# EAGLE design AS3364 DG412 bus mixer v1.2 (EAGLE 9.6.2)
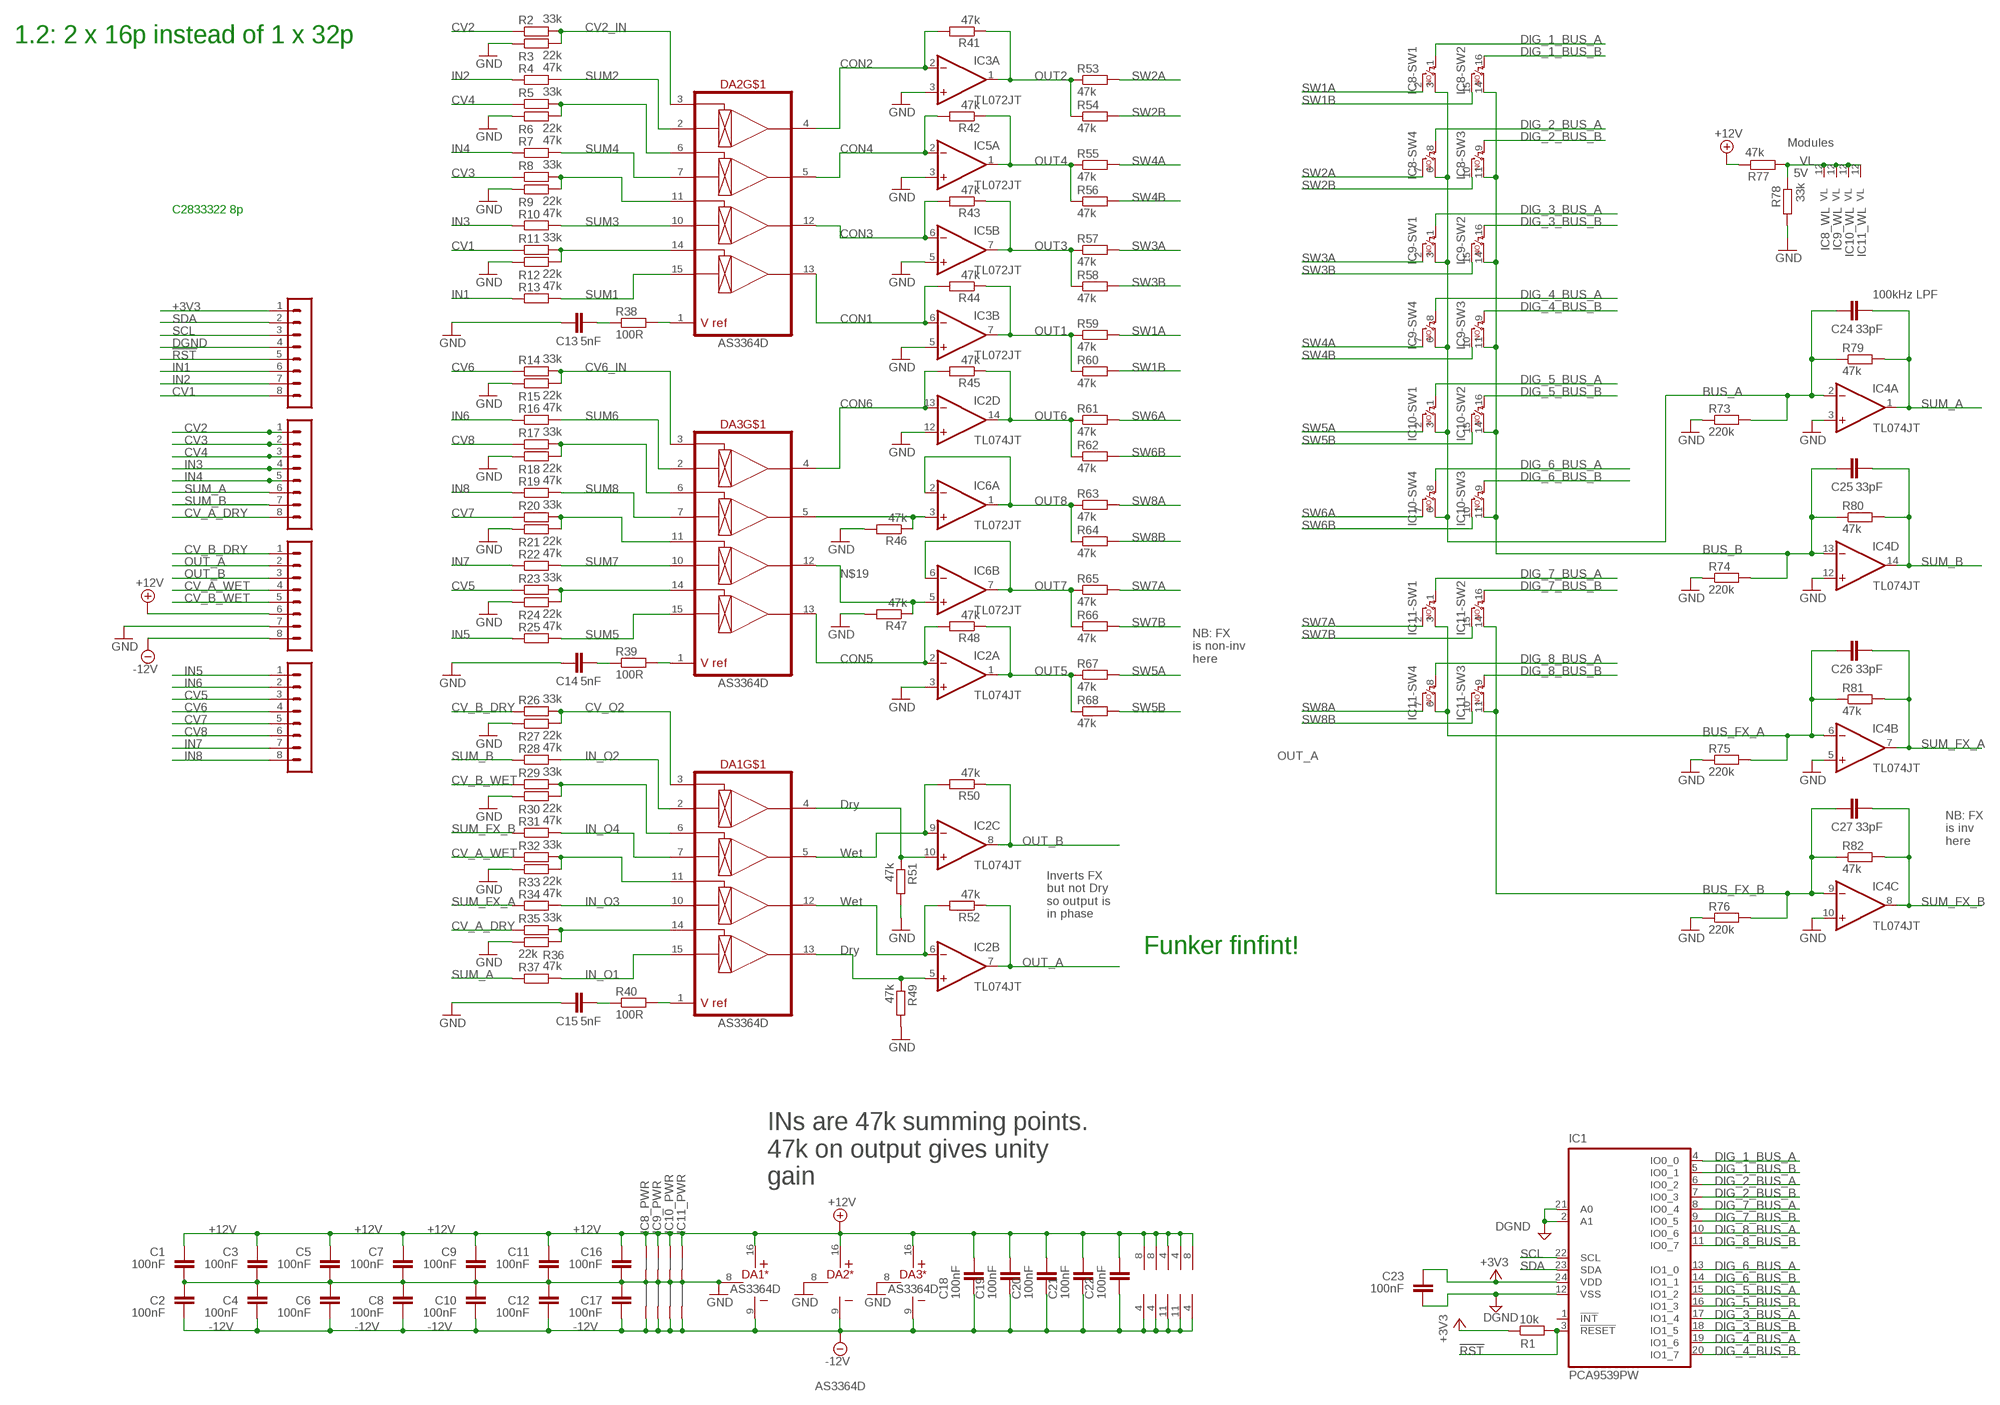
[diagram p0: schematic, sheet 1]

## Parts
C1  100nF  C-EUC0402  [C0402]
C2  100nF  C-EUC0402  [C0402]
C3  100nF  C-EUC0402  [C0402]
C4  100nF  C-EUC0402  [C0402]
C5  100nF  C-EUC0402  [C0402]
C6  100nF  C-EUC0402  [C0402]
C7  100nF  C-EUC0402  [C0402]
C8  100nF  C-EUC0402  [C0402]
C9  100nF  C-EUC0402  [C0402]
C10  100nF  C-EUC0402  [C0402]
C11  100nF  C-EUC0402  [C0402]
C12  100nF  C-EUC0402  [C0402]
C13  5nF  C-EU-J  [C0402-J]
C14  5nF  C-EU-J  [C0402-J]
C15  5nF  C-EU-J  [C0402-J]
C16  100nF  C-EUC0402  [C0402]
C17  100nF  C-EUC0402  [C0402]
C18  100nF  C-EUC0402  [C0402]
C19  100nF  C-EUC0402  [C0402]
C20  100nF  C-EUC0402  [C0402]
C21  100nF  C-EUC0402  [C0402]
C22  100nF  C-EUC0402  [C0402]
C23  100nF  C-EUC0402  [C0402]
C24  33pF  C-EU-J  [C0402-J]
C25  33pF  C-EU-J  [C0402-J]
C26  33pF  C-EU-J  [C0402-J]
C27  33pF  C-EU-J  [C0402-J]
DA1  AS3364D  [DIL16J]
DA2  AS3364D  [DIL16J]
DA3  AS3364D  [DIL16J]
IC1  PCA9539PW  [TSSOP24J]
IC2  TL074JT  [TSSOP14J]
IC3  TL072JT  [TSSOP8J]
IC4  TL074JT  [TSSOP14J]
IC5  TL072JT  [TSSOP8J]
IC6  TL072JT  [TSSOP8J]
IC8  DG412-J  [DIL16J]
IC9  DG412-J  [DIL16J]
IC10  DG412-J  [DIL16J]
IC11  DG412-J  [DIL16J]
R1  10k  R-EU_R0402  [R0402]
R2  33k  R-EU_R0402  [R0402]
R3  22k  R-EU_R0402  [R0402]
R4  47k  R-EU_R0402  [R0402]
R5  33k  R-EU_R0402  [R0402]
R6  22k  R-EU_R0402  [R0402]
R7  47k  R-EU_R0402  [R0402]
R8  33k  R-EU_R0402  [R0402]
R9  22k  R-EU_R0402  [R0402]
R10  47k  R-EU_R0402  [R0402]
R11  33k  R-EU_R0402  [R0402]
R12  22k  R-EU_R0402  [R0402]
R13  47k  R-EU_R0402  [R0402]
R14  33k  R-EU_R0402  [R0402]
R15  22k  R-EU_R0402  [R0402]
R16  47k  R-EU_R0402  [R0402]
R17  33k  R-EU_R0402  [R0402]
R18  22k  R-EU_R0402  [R0402]
R19  47k  R-EU_R0402  [R0402]
R20  33k  R-EU_R0402  [R0402]
R21  22k  R-EU_R0402  [R0402]
R22  47k  R-EU_R0402  [R0402]
R23  33k  R-EU_R0402  [R0402]
R24  22k  R-EU_R0402  [R0402]
R25  47k  R-EU_R0402  [R0402]
R26  33k  R-EU_R0402  [R0402]
R27  22k  R-EU_R0402  [R0402]
R28  47k  R-EU_R0402  [R0402]
R29  33k  R-EU_R0402  [R0402]
R30  22k  R-EU_R0402  [R0402]
R31  47k  R-EU_R0402  [R0402]
R32  33k  R-EU_R0402  [R0402]
R33  22k  R-EU_R0402  [R0402]
R34  47k  R-EU_R0402  [R0402]
R35  33k  R-EU_R0402  [R0402]
R36  22k  R-EU_R0402  [R0402]
R37  47k  R-EU_R0402  [R0402]
R38  100R  R-EU_R0402  [R0402]
R39  100R  R-EU_R0402  [R0402]
R40  100R  R-EU_R0402  [R0402]
R41  47k  R-EU_R0402  [R0402]
R42  47k  R-EU_R0402  [R0402]
R43  47k  R-EU_R0402  [R0402]
R44  47k  R-EU_R0402  [R0402]
R45  47k  R-EU_R0402  [R0402]
R46  47k  R-EU_R0402  [R0402]
R47  47k  R-EU_R0402  [R0402]
R48  47k  R-EU_R0402  [R0402]
R49  47k  R-EU_R0402  [R0402]
R50  47k  R-EU_R0402  [R0402]
R51  47k  R-EU_R0402  [R0402]
R52  47k  R-EU_R0402  [R0402]
R53  47k  R-EU_R0402  [R0402]
R54  47k  R-EU_R0402  [R0402]
R55  47k  R-EU_R0402  [R0402]
R56  47k  R-EU_R0402  [R0402]
R57  47k  R-EU_R0402  [R0402]
R58  47k  R-EU_R0402  [R0402]
R59  47k  R-EU_R0402  [R0402]
R60  47k  R-EU_R0402  [R0402]
R61  47k  R-EU_R0402  [R0402]
R62  47k  R-EU_R0402  [R0402]
R63  47k  R-EU_R0402  [R0402]
R64  47k  R-EU_R0402  [R0402]
R65  47k  R-EU_R0402  [R0402]
R66  47k  R-EU_R0402  [R0402]
R67  47k  R-EU_R0402  [R0402]
R68  47k  R-EU_R0402  [R0402]
R73  220k  R-EU_R0402  [R0402]
R74  220k  R-EU_R0402  [R0402]
R75  220k  R-EU_R0402  [R0402]
R76  220k  R-EU_R0402  [R0402]
R77  47k  R-EU_R0402  [R0402]
R78  33k  R-EU_R0402  [R0402]
R79  47k  R-EU_R0402  [R0402]
R80  47k  R-EU_R0402  [R0402]
R81  47k  R-EU_R0402  [R0402]
R82  47k  R-EU_R0402  [R0402]
SV1  MA08-1JP  [SIP-PIN08-1J]
SV3  MA08-1JP  [SIP-PIN08-1J]
SV4  MA08-1JP  [SIP-PIN08-1J]
SV33  MA08-1JP  [SIP-PIN08-1J]

## Nets
!RST: IC1.3(!RESET) R1.2 SV33.5
+3V3: C23.2 IC1.24(VDD) R1.1 SV33.1
+12V: C1.2 C3.2 C5.2 C7.2 C9.2 C11.2 C16.2 C18.2 C19.2 C20.2 C21.2 C22.2 DA1.16(*:V+) DA2.16(*:V+) DA3.16(*:V+) IC2.4(P:V+) IC3.8(P:V+) IC4.4(P:V+) IC5.8(P:V+) IC6.8(P:V+) IC8.13(_PWR:+15V) IC9.13(_PWR:+15V) IC10.13(_PWR:+15V) IC11.13(_PWR:+15V) R77.1 SV4.6
-12V: C2.1 C4.1 C6.1 C8.1 C10.1 C12.1 C17.1 C18.1 C19.1 C20.1 C21.1 C22.1 DA1.9(*:V-) DA2.9(*:V-) DA3.9(*:V-) IC2.11(P:V-) IC3.4(P:V-) IC4.11(P:V-) IC5.4(P:V-) IC6.4(P:V-) IC8.4(_PWR:-15V) IC9.4(_PWR:-15V) IC10.4(_PWR:-15V) IC11.4(_PWR:-15V) SV4.8
BUS_A: C24.1 IC4.2(A:-IN) IC8.3(-SW1:S) IC8.6(-SW4:S) IC9.3(-SW1:S) IC9.6(-SW4:S) IC10.3(-SW1:S) IC10.6(-SW4:S) R73.2 R79.1
BUS_B: C25.1 IC4.13(D:-IN) IC8.11(-SW3:S) IC8.14(-SW2:S) IC9.11(-SW3:S) IC9.14(-SW2:S) IC10.11(-SW3:S) IC10.14(-SW2:S) R74.2 R80.1
BUS_FX_A: C26.1 IC4.6(B:-IN) IC11.3(-SW1:S) IC11.6(-SW4:S) R75.2 R81.1
BUS_FX_B: C27.1 IC4.9(C:-IN) IC11.11(-SW3:S) IC11.14(-SW2:S) R76.2 R82.1
CON1: DA2.13(OUT4) IC3.6(B:-IN) R44.2
CON2: DA2.4(OUT1) IC3.2(A:-IN) R41.2
CON3: DA2.12(OUT3) IC5.6(B:-IN) R43.2
CON4: DA2.5(OUT2) IC5.2(A:-IN) R42.2
CON5: DA3.13(OUT4) IC2.2(A:-IN) R48.2
CON6: DA3.4(OUT1) IC2.13(D:-IN) R45.2
CON_O1: DA1.12(OUT3) IC2.6(B:-IN) R52.2
CV1: R11.1 SV33.8
CV2: R2.1 SV1.1
CV2_IN: DA2.3(CV1) R2.2 R3.2
CV3: R8.1 SV1.2
CV4: R5.1 SV1.3
CV5: R23.1 SV3.3
CV6: R14.1 SV3.4
CV6_IN: DA3.3(CV1) R14.2 R15.2
CV7: R20.1 SV3.5
CV8: R17.1 SV3.6
CV_A_DRY: R35.1 SV1.8
CV_A_WET: R32.1 SV4.4
CV_B_DRY: R26.1 SV4.1
CV_B_WET: R29.1 SV4.5
CV_O2: DA1.3(CV1) R26.2 R27.2
DGND: C23.1 IC1.2(A1) IC1.12(VSS) IC1.21(A0) SV33.4
DIG_1_BUS_A: IC1.4(IO0_0) IC8.1(-SW1:C)
DIG_1_BUS_B: IC1.5(IO0_1) IC8.16(-SW2:C)
DIG_2_BUS_A: IC1.6(IO0_2) IC8.8(-SW4:C)
DIG_2_BUS_B: IC1.7(IO0_3) IC8.9(-SW3:C)
DIG_3_BUS_A: IC1.17(IO1_4) IC9.1(-SW1:C)
DIG_3_BUS_B: IC1.18(IO1_5) IC9.16(-SW2:C)
DIG_4_BUS_A: IC1.19(IO1_6) IC9.8(-SW4:C)
DIG_4_BUS_B: IC1.20(IO1_7) IC9.9(-SW3:C)
DIG_5_BUS_A: IC1.15(IO1_2) IC10.1(-SW1:C)
DIG_5_BUS_B: IC1.16(IO1_3) IC10.16(-SW2:C)
DIG_6_BUS_A: IC1.13(IO1_0) IC10.8(-SW4:C)
DIG_6_BUS_B: IC1.14(IO1_1) IC10.9(-SW3:C)
DIG_7_BUS_A: IC1.8(IO0_4) IC11.1(-SW1:C)
DIG_7_BUS_B: IC1.9(IO0_5) IC11.16(-SW2:C)
DIG_8_BUS_A: IC1.10(IO0_6) IC11.8(-SW4:C)
DIG_8_BUS_B: IC1.11(IO0_7) IC11.9(-SW3:C)
GND: C1.1 C2.2 C3.1 C4.2 C5.1 C6.2 C7.1 C8.2 C9.1 C10.2 C11.1 C12.2 C13.1 C14.1 C15.1 C16.1 C17.2 DA1.8(*:GND) DA2.8(*:GND) DA3.8(*:GND) IC2.3(A:+IN) IC2.12(D:+IN) IC3.3(A:+IN) IC3.5(B:+IN) IC4.3(A:+IN) IC4.5(B:+IN) IC4.10(C:+IN) IC4.12(D:+IN) IC5.3(A:+IN) IC5.5(B:+IN) IC8.5(_PWR:AGND) IC9.5(_PWR:AGND) IC10.5(_PWR:AGND) IC11.5(_PWR:AGND) R3.1 R6.1 R9.1 R12.1 R15.1 R18.1 R21.1 R24.1 R27.1 R30.1 R33.1 R36.1 R46.2 R47.2 R49.2 R51.2 R73.1 R74.1 R75.1 R76.1 R78.2 SV4.7
IN1: R13.1 SV33.6
IN2: R4.1 SV33.7
IN3: R10.1 SV1.4
IN4: R7.1 SV1.5
IN5: R25.1 SV3.1
IN6: R16.1 SV3.2
IN7: R22.1 SV3.7
IN8: R19.1 SV3.8
IN_O1: DA1.15(IN4) R37.2
IN_O2: DA1.2(IN1) R28.2
IN_O3: DA1.10(IN3) R34.2
IN_O4: DA1.7(IN2) R31.2
N$1: DA3.1(VREF) R39.2
N$2: DA2.1(VREF) R38.2
N$3: DA3.6(CV2) R17.2 R18.2
N$4: DA3.5(OUT2) IC6.3(A:+IN) R46.1
N$5: DA3.11(CV3) R20.2 R21.2
N$6: DA1.5(OUT2) IC2.9(C:-IN) R50.2
N$7: DA3.14(CV4) R23.2 R24.2
N$8: C14.2 R39.1
N$9: DA1.1(VREF) R40.2
N$10: DA2.6(CV2) R5.2 R6.2
N$11: DA1.6(CV2) R29.2 R30.2
N$12: DA2.11(CV3) R8.2 R9.2
N$13: DA1.11(CV3) R32.2 R33.2
N$14: C13.2 R38.1
N$15: DA1.14(CV4) R35.2 R36.2
N$16: C15.2 R40.1
N$17: DA1.4(OUT1) IC2.10(C:+IN) R51.1
N$18: DA1.13(OUT4) IC2.5(B:+IN) R49.1
N$19: DA3.12(OUT3) IC6.5(B:+IN) R47.1
N$21: DA2.14(CV4) R11.2 R12.2
OUT1: IC3.7(B:OUT) R44.1 R59.1 R60.1
OUT2: IC3.1(A:OUT) R41.1 R53.1 R54.1
OUT3: IC5.7(B:OUT) R43.1 R57.1 R58.1
OUT4: IC5.1(A:OUT) R42.1 R55.1 R56.1
OUT5: IC2.1(A:OUT) R48.1 R67.1 R68.1
OUT6: IC2.14(D:OUT) R45.1 R61.1 R62.1
OUT7: IC6.6(B:-IN) IC6.7(B:OUT) R65.1 R66.1
OUT8: IC6.1(A:OUT) IC6.2(A:-IN) R63.1 R64.1
OUT_A: IC2.7(B:OUT) R52.1 SV4.2
OUT_B: IC2.8(C:OUT) R50.1 SV4.3
SCL: IC1.22(SCL) SV33.3
SDA: IC1.23(SDA) SV33.2
SUM1: DA2.15(IN4) R13.2
SUM2: DA2.2(IN1) R4.2
SUM3: DA2.10(IN3) R10.2
SUM4: DA2.7(IN2) R7.2
SUM5: DA3.15(IN4) R25.2
SUM6: DA3.2(IN1) R16.2
SUM7: DA3.10(IN3) R22.2
SUM8: DA3.7(IN2) R19.2
SUM_A: C24.2 IC4.1(A:OUT) R37.1 R79.2 SV1.6
SUM_B: C25.2 IC4.14(D:OUT) R28.1 R80.2 SV1.7
SUM_FX_A: C26.2 IC4.7(B:OUT) R34.1 R81.2
SUM_FX_B: C27.2 IC4.8(C:OUT) R31.1 R82.2
SW1A: IC8.2(-SW1:D) R59.2
SW1B: IC8.15(-SW2:D) R60.2
SW2A: IC8.7(-SW4:D) R53.2
SW2B: IC8.10(-SW3:D) R54.2
SW3A: IC9.2(-SW1:D) R57.2
SW3B: IC9.15(-SW2:D) R58.2
SW4A: IC9.7(-SW4:D) R55.2
SW4B: IC9.10(-SW3:D) R56.2
SW5A: IC10.2(-SW1:D) R67.2
SW5B: IC10.15(-SW2:D) R68.2
SW6A: IC10.7(-SW4:D) R61.2
SW6B: IC10.10(-SW3:D) R62.2
SW7A: IC11.2(-SW1:D) R65.2
SW7B: IC11.15(-SW2:D) R66.2
SW8A: IC11.7(-SW4:D) R63.2
SW8B: IC11.10(-SW3:D) R64.2
VL: IC8.12(_WL:VL) IC9.12(_WL:VL) IC10.12(_WL:VL) IC11.12(_WL:VL) R77.2 R78.1
Unconnected: IC1.1(!INT)

## Notes on the sheet
- 1.2: 2 x 16p instead of 1 x 32p
- Modules
- 5V
- C2833322 8p
- 100kHz LPF
- NB: FX
  is non-inv
  here
- Dry
- NB: FX
  is inv
  here
- Wet
- Wet
- Inverts FX
  but not Dry
  so output is
  in phase
- Dry | Funker finfint!
- INs are 47k summing points.
  47k on output gives unity
  gain

## Library data of the parts
C1-C12 C16-C23 = rcl:C-EU: CAPACITOR, European symbol; SPICEPREFIX: C
C13-C15 C24-C27 = joakim:C-EU-J: CAPACITOR, European symbol
DA1-DA3 = joakim:AS3364: AS3364 quad linear VCA, CEM3360 style. CV is 0 to 2V Vcc-Vee = 26V max, so +/-12V or +15V/-9V
IC1 = joakim:PCA9539: 16ch i/o expander. RPW version resets only internal statemachine to get out of stuck i2c-bus, other versions also reset outputs. Interrupt output requires external pull-up resistor for all variants. https://www.nxp.com/docs/en/data-sheet/PCA9539_PCA9539R.pdf
IC2 IC4 = joakim:TL074J: OP AMP
IC3 IC5 IC6 = joakim:TL072J: OP AMP
IC8-IC11 = joakim:DG412-J: Quad switch, normally open
R1-R68 R73-R82 = rcl:R-EU_: RESISTOR, European symbol; SPICEPREFIX: R
SV1 SV3 SV4 SV33 = joakim:MA08-1J: PIN HEADER

## Board
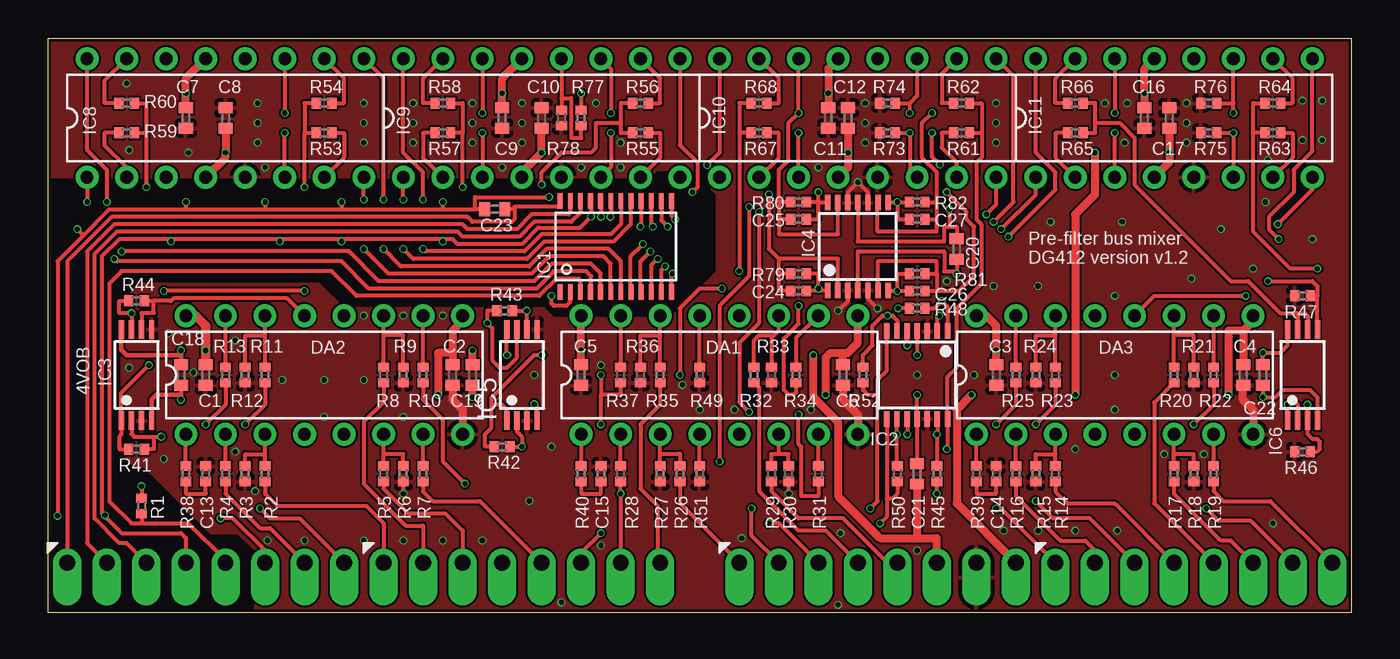
[diagram p1: board, top side]
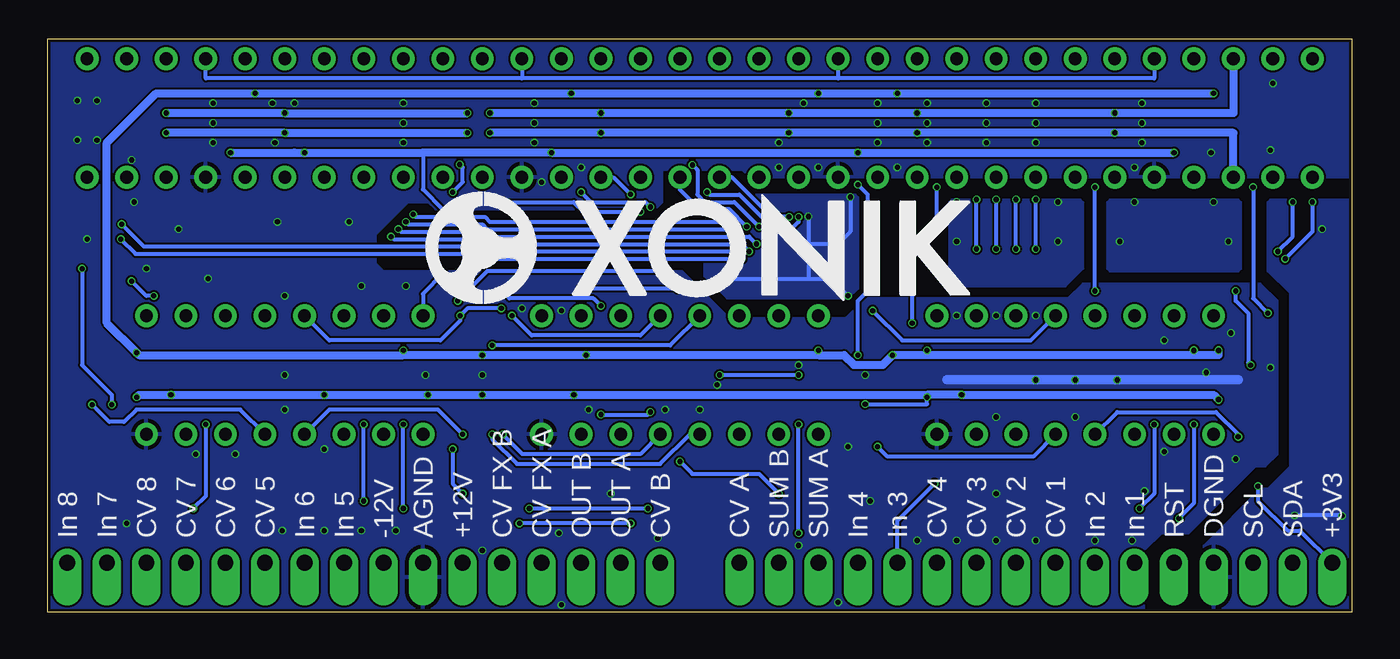
[diagram p2: board, bottom side, seen from below]

Size 83.82 x 36.83 mm. Coordinates in mm from the lower left corner, seen from the top.
Outline: 0,0 83.82,0 83.82,36.83 0,36.83 0,0
Copper layers (1*16): Top 0.035mm / dielectric 1.6mm / Bottom 0.035mm
Design rules "jlcpcb-2layers": minimum track width 5mil, minimum drill 0.3mm, track to track 5mil, track to pad 5mil, pad to pad 5mil, via to via 5mil, smd to smd 5mil, copper to edge 0.2mm, drill to drill 6mil, minimum pad ring 10mil, minimum via ring 3mil, stop-mask expansion 4mil, vias tented up to drill 0mil, thermal gap 10mil

### Footprints (pad centres in the part's own frame; a part is rotated, then mirrored left to right if it is on the bottom)
C0402 = smd 0.7 x 0.9: 1 -0.65,0; 2 0.65,0
C0402-J = smd 0.6 x 0.7: 1 -0.5,0; 2 0.5,0
DIL16J = drill 0.813: 1 -8.89,-3.81; 2 -6.35,-3.81; 3 -3.81,-3.81; 4 -1.27,-3.81; 5 1.27,-3.81; 6 3.81,-3.81; 7 6.35,-3.81; 8 8.89,-3.81; 9 8.89,3.81; 10 6.35,3.81; 11 3.81,3.81; 12 1.27,3.81; 13 -1.27,3.81; 14 -3.81,3.81; 15 -6.35,3.81; 16 -8.89,3.81
TSSOP24J = smd 0.305 x 0.991: 1 -3.575,-2.918; 2 -2.925,-2.918; 3 -2.275,-2.918; 4 -1.625,-2.918; 5 -0.975,-2.918; 6 -0.325,-2.918; 7 0.325,-2.918; 8 0.975,-2.918; 9 1.625,-2.918; 10 2.275,-2.918; 11 2.925,-2.918; 12 3.575,-2.918; 13 3.575,2.918; 14 2.925,2.918; 15 2.275,2.918; 16 1.625,2.918; 17 0.975,2.918; 18 0.325,2.918; 19 -0.325,2.918; 20 -0.975,2.918; 21 -1.625,2.918; 22 -2.275,2.918; 23 -2.925,2.918; 24 -3.575,2.918
TSSOP14J = smd 0.35 x 1: 1 -1.95,-2.825; 2 -1.3,-2.825; 3 -0.65,-2.825; 4 0,-2.825; 5 0.65,-2.825; 6 1.3,-2.825; 7 1.95,-2.825; 8 1.95,2.825; 9 1.3,2.825; 10 0.65,2.825; 11 0,2.825; 12 -0.65,2.825; 13 -1.3,2.825; 14 -1.95,2.825
TSSOP8J = smd 1.2 x 0.35: 1 -2.925,0.975; 2 -2.925,0.325; 3 -2.925,-0.325; 4 -2.925,-0.975; 5 2.925,-0.975; 6 2.925,-0.325; 7 2.925,0.325; 8 2.925,0.975
R0402 = smd 0.6 x 0.7: 1 -0.5,0; 2 0.5,0
SIP-PIN08-1J = drill 1.016 offset: 1 -8.89,0; 2 -6.35,0; 3 -3.81,0; 4 -1.27,0; 5 1.27,0; 6 3.81,0; 7 6.35,0; 8 8.89,0

### Placement (x,y rotation side)
C1  10.16,15.24 90 top
C2  26.04,15.24 270 top
C3  60.96,15.24 90 top
C4  76.83,15.24 270 top
C5  34.29,15.24 90 top
C6  51.12,15.24 270 top
C7  8.89,31.75 90 top
C8  11.43,31.75 90 top
C9  29.21,31.75 90 top
C10  31.75,31.75 90 top
C11  50.16,31.75 90 top
C12  51.44,31.75 90 top
C13  10.16,8.89 270 top
C14  60.96,8.89 270 top
C15  35.56,8.89 270 top
C16  70.48,31.75 90 top
C17  72.07,31.75 90 top
C18  8.57,15.24 90 top
C19  27.3,15.24 90 top
C20  58.42,23.34 270 top
C21  55.88,8.89 270 top
C22  78.11,15.24 90 top
C23  28.73,25.88 0 top
C24  48.26,21.75 0 top
C25  48.26,25.24 0 top
C26  55.88,21.75 180 top
C27  55.88,25.24 180 top
DA1  43.18,15.24 0 top
DA2  17.78,15.24 0 top
DA3  68.58,15.24 0 top
IC1  36.51,23.5 0 top
IC2  55.88,15.24 180 top
IC3  5.71,15.24 90 top
IC4  52.07,23.5 0 top
IC5  30.48,15.24 90 top
IC6  80.64,15.24 90 top
IC8  11.43,31.75 0 top
IC9  31.75,31.75 0 top
IC10  52.07,31.75 0 top
IC11  72.39,31.75 0 top
R1  6.03,6.83 270 top
R2  13.97,8.89 90 top
R3  12.7,8.89 90 top
R4  11.43,8.89 90 top
R5  21.59,8.89 90 top
R6  22.86,8.89 90 top
R7  24.13,8.89 90 top
R8  21.59,15.24 90 top
R9  22.86,15.24 90 top
R10  24.13,15.24 90 top
R11  13.97,15.24 90 top
R12  12.7,15.24 90 top
R13  11.43,15.24 90 top
R14  64.77,8.89 90 top
R15  63.5,8.89 90 top
R16  62.23,8.89 90 top
R17  72.39,8.89 90 top
R18  73.66,8.89 90 top
R19  74.93,8.89 90 top
R20  72.39,15.24 90 top
R21  73.66,15.24 90 top
R22  74.93,15.24 90 top
R23  64.77,15.24 90 top
R24  63.5,15.24 90 top
R25  62.23,15.24 90 top
R26  40.64,8.89 90 top
R27  39.37,8.89 90 top
R28  36.83,8.89 90 top
R29  46.51,8.89 90 top
R30  47.62,8.89 90 top
R31  49.53,8.89 90 top
R32  45.4,15.24 90 top
R33  46.51,15.24 90 top
R34  48.1,15.24 90 top
R35  39.37,15.24 90 top
R36  38.1,15.24 90 top
R37  36.83,15.24 90 top
R38  8.89,8.89 90 top
R39  59.69,8.89 90 top
R40  34.29,8.89 90 top
R41  5.71,10.48 0 top
R42  29.21,10.64 0 top
R43  29.37,19.37 0 top
R44  5.71,20 0 top
R45  57.15,8.89 90 top
R46  80.64,10.32 180 top
R47  80.64,20.32 180 top
R48  55.88,19.53 180 top
R49  41.91,15.24 270 top
R50  54.61,8.89 90 top
R51  41.91,8.89 270 top
R52  52.39,15.24 90 top
R53  17.78,30.8 0 top
R54  17.78,32.7 0 top
R55  38.1,30.8 0 top
R56  38.1,32.7 0 top
R57  25.4,30.8 180 top
R58  25.4,32.7 180 top
R59  5.08,30.8 180 top
R60  5.08,32.7 180 top
R61  58.74,30.8 180 top
R62  58.74,32.7 180 top
R63  78.74,30.8 0 top
R64  78.74,32.7 0 top
R65  66.04,30.8 180 top
R66  66.04,32.7 180 top
R67  45.72,30.8 0 top
R68  45.72,32.7 0 top
R73  53.98,30.8 0 top
R74  53.98,32.7 0 top
R75  74.61,30.8 0 top
R76  74.61,32.7 0 top
R77  34.29,31.75 270 top
R78  33.02,31.75 270 top
R79  48.26,20.64 0 top
R80  48.26,26.35 0 top
R81  55.88,20.64 180 top
R82  55.88,26.35 180 top
SV1  30.48,3.17 0 top
SV3  73.66,3.17 0 top
SV4  53.34,3.17 0 top
SV33  10.16,3.17 0 top
U$1  [XONIK_LOGO_35]  59.53,19.84 0 bottom

### Tracks (layer width: path | path; a pad name or v marks a point on that pad's centre or on a via)
!RST
  Top 0.254: IC1.3 34.24,21.32 34.13,21.43 32.7,21.43 31.59,20.32 19.84,20.32 18.26,21.91 4.76,21.91 3.97,21.11 3.97,7.14 5.4,5.71 6.03,5.71 | SV33.5 11.43,3.33 9.05,5.71 6.03,5.71 | R1.2 6.03,5.71
+3V3  (via drill 0.33)
  Top 0.254: IC1.24 32.94,26.09 32.88,26.04 30,26.04 30,25.88 | 30,25.88 C23.2 | 30,25.88 30,25.24 29.84,25.08 27.3,25.08 26.99,25.4 4.13,25.4 1.27,22.54 SV33.1 | v6.03,8.1 R1.1
  Bottom 0.254: v6.03,8.1 6.03,7.14 4.13,5.24 3.33,5.24 SV33.1
+12V  (via drill 0.33, 0.35)
  Top 0.254: v34.29,33.34 R77.1 | IC4.4 52.07,23.18 57.61,23.18 57.63,23.16 57.63,21.89 58.26,21.89 v58.42,21.73 C20.2 | C22.2 v78.11,16.67 79.22,16.67 79.69,17.14 79.69,18.14 IC6.8 | IC2.4 v55.88,16.51 | C20.2 | IC5.8 29.5,16.53 v29.53,16.51
  Top 0.305: IC3.8 4.74,16.85 5.08,16.51 8.57,16.51 | 8.57,16.51 C18.2 | 8.57,16.51 v8.57,16.83
  Top 0.508: C3.2 v60.96,16.83 60.96,18.41 60.33,19.05 DA3.16 | C5.2 v34.29,16.83 DA1.16 | C7.2 v8.89,33.34 8.89,34.29 IC8.13 | C9.2 v29.21,33.34 29.21,34.29 IC9.13 | C11.2 v50.16,33.34 50.16,34.92 IC10.13 | C16.2 v70.48,33.34 70.48,34.92 IC11.13 | C19.2 v27.3,16.83 | SV4.6 57.15,4.76 55.88,4.76 | v49.21,16.51 49.21,13.81 50.8,12.22 50.8,7.46 53.5,4.76 55.88,4.76 | C21.2 55.88,4.76
  Top 0.61: C1.2 v10.16,16.83 10.16,18.41 9.53,19.05 DA2.16
  Bottom 0.254: v58.42,21.73 59.69,20.46 DA3.16
  Bottom 0.508: 34.29,16.51 v49.21,16.51 v55.88,16.51 60.96,16.51 | v8.57,16.83 8.57,16.51 10.16,16.51 | v8.89,33.34 v29.21,33.34 v34.29,33.34 v50.16,33.34 v70.48,33.34 76.83,33.34 80.01,30.16 80.01,18.57 v78.11,16.67 77.95,16.51 60.96,16.51 | v34.29,16.83 34.29,16.51 | v60.96,16.83 60.96,16.51 | 10.16,16.51 27.3,16.51 | 27.3,16.51 v29.53,16.51 30.16,15.88 30.18,15.89 32.01,15.89 32.63,16.51 34.29,16.51 | v10.16,16.83 10.16,16.51 | v27.3,16.83 27.3,16.51
-12V  (via drill 0.33, 0.35)
  Top 0.254: v55.88,13.97 IC2.11 C21.1 | IC4.11 52.07,23.81 57.63,23.81 57.63,24.77 57.94,24.77 | C22.1 v78.11,13.81 78.9,13.81 79.38,14.29 81.12,14.29 81.62,13.79 IC6.4 | 57.94,24.77 58.42,24.77 C20.1 | v57.94,25.89 57.94,24.77 | IC5.4 31.45,13.19 v31.27,13.37
  Top 0.305: IC3.4 6.69,13.68 6.99,13.97 8.57,13.97 | 8.57,13.97 C18.1 | 8.57,13.97 v8.57,13.65
  Top 0.508: DA2.9 26.67,18.73 26.04,18.1 26.04,16.67 | 26.04,16.67 C2.1 | 26.04,16.67 25.08,16.67 v25.08,13.97 | DA3.9 77.47,18.73 76.83,18.1 | 76.83,18.1 C4.1 | 76.83,18.1 75.88,18.1 v75.88,13.97 | C6.1 51.12,16.67 | C8.1 v11.43,29.53 11.43,29.21 IC8.4 | IC9.4 30.48,28.26 v31.75,29.53 C10.1 | C12.1 v51.44,29.53 51.44,28.57 IC10.4 | C17.1 v72.07,29.53 72.07,28.89 IC11.4 | v67.31,29.53 67.31,26.83 66.04,25.56 v66.04,13.97 | SV4.8 58.42,6.99 58.42,13.02 v59.37,13.97 | 51.12,16.67 51.44,16.67 52.07,17.3 DA1.9 | v27.3,13.81 C19.1 | v50.01,13.97 50.01,16.35 50.32,16.67 51.12,16.67
  Bottom 0.254: v57.94,25.89 58.42,25.89 59.69,27.16 59.69,29.53 | v67.31,29.53 67.94,29.53 | v31.27,13.37 27.3,13.37 27.3,13.97
  Bottom 0.508: v8.57,13.65 8.89,13.97 v25.08,13.97 27.3,13.97 | 27.3,13.97 v50.01,13.97 v55.88,13.97 v59.37,13.97 v66.04,13.97 v75.88,13.97 77.95,13.97 v78.11,13.81 | v11.43,29.53 v31.75,29.53 v51.44,29.53 59.69,29.53 67.94,29.53 v72.07,29.53 | 27.3,13.97 v27.3,13.81
BUS_A  (via drill 0.33)
  Top 0.254: v27.94,30.8 IC9.3 | v36.2,30.8 36.2,28.57 IC9.6 | IC8.6 v15.24,30.8 | IC10.3 v48.26,30.8 | IC10.6 55.4,28.42 v55.4,30.8 R73.2 | IC4.2 50.8,20.7 50.8,22.7 46.99,22.7 | v46.35,26.85 46.35,23.34 46.99,22.7 | R79.1 46.99,20.64 46.99,21.75 | 46.99,21.75 46.99,22.7 | C24.1 46.99,21.75
  Bottom 0.254: IC10.3 47.47,27.94 46.37,26.85 v46.35,26.85
  Bottom 0.508: IC8.3 7.62,30.8 v15.24,30.8 v27.94,30.8 v36.2,30.8 v48.26,30.8 v55.4,30.8
BUS_B  (via drill 0.33)
  Top 0.254: IC8.11 v15.24,32.07 | IC9.14 v27.94,32.07 | IC9.11 36.2,34.92 v36.2,32.07 | IC10.14 v48.26,32.07 47.62,31.43 47.62,29.05 46.99,28.42 46.99,26.35 | v55.4,32.07 55.4,32.7 | R74.2 55.4,32.7 | 46.99,26.35 46.99,25.24 | 46.99,25.24 46.99,24.29 50.8,24.29 50.8,26.29 IC4.13 | R80.1 46.99,26.35 | IC10.11 55.88,33.18 55.4,32.7 | C25.1 46.99,25.24
  Bottom 0.508: IC8.14 7.62,32.07 v15.24,32.07 v27.94,32.07 v36.2,32.07 v48.26,32.07 v55.4,32.07
BUS_FX_A  (via drill 0.33)
  Top 0.254: IC11.3 v68.58,30.8 | IC11.6 v76.2,30.8 R75.2 | R81.1 57.15,20.64 | IC4.6 53.34,20.7 53.34,22.54 57.15,22.54 57.15,21.75 | v57.34,28.77 56.83,29.27 v56.83,30.8 | 57.15,21.75 57.15,20.64 | v57.78,26.99 59.05,25.72 59.05,25.24 59.53,24.77 59.53,21.59 58.58,20.64 57.15,20.64 | C26.1 57.15,21.75
  Bottom 0.254: v57.34,28.77 57.15,28.57 57.15,27.62 v57.78,26.99
  Bottom 0.508: v76.2,30.8 v68.58,30.8 v56.83,30.8
BUS_FX_B  (via drill 0.33)
  Top 0.254: IC11.14 v68.58,32.07 | v76.2,32.07 76.2,32.7 | 76.2,32.7 IC11.11 | R76.2 76.2,32.7 | R82.1 57.15,26.35 | 57.15,25.24 57.15,24.45 53.34,24.45 53.34,26.29 IC4.9 | 57.15,25.24 57.15,26.35 | 57.15,26.35 57.15,28.26 56.2,29.21 56.2,31.43 v56.83,32.07 | C27.1 57.15,25.24
  Bottom 0.508: v76.2,32.07 v68.58,32.07 v56.83,32.07
CON1
  Top 0.254: DA2.13 15.4,20.16 8.1,20.16 7.94,20 6.83,20 | IC3.6 6.03,18.17 6.03,19.21 6.83,19.21 6.83,20 | R44.2 6.83,20
CON2  (via drill 0.35)
  Top 0.254: IC3.2 5.39,11.44 5.56,11.27 v7.3,11.27 6.83,11.27 6.83,10.48 R41.2
  Bottom 0.254: DA2.4 15.08,12.86 8.73,12.86 7.3,11.43 v7.3,11.27
CON3  (via drill 0.35)
  Top 0.254: R43.2 v30.8,19.37 v30.8,19.36 IC5.6
  Bottom 0.254: DA2.12 20.64,17.46 28.89,17.46 v30.8,19.37
CON4  (via drill 0.33)
  Top 0.254: R42.2 v30.48,10.64 30.45,10.67 30.48,10.7 30.48,11.27 30.16,11.6 IC5.2
  Bottom 0.254: DA2.5 20.48,10 29.84,10 v30.48,10.64
CON5  (via drill 0.33)
  Top 0.254: v57.31,19.05 57.32,19.04 57.18,18.89 IC2.2 | R48.2 v54.66,19.53
  Bottom 0.254: DA3.13 65.72,17.46 58.58,17.46 57.31,18.73 v57.31,19.05 56.83,19.53 v54.66,19.53
CON6  (via drill 0.33)
  Top 0.254: R45.2 v57.15,11.43 57.18,11.46 IC2.13
  Bottom 0.254: DA3.4 65.72,13.02 58.74,13.02 v57.15,11.43
CON_O1  (via drill 0.33)
  Top 0.254: IC2.6 54.61,18.09 54.61,18.73 54.29,19.05 v53.98,19.05 53.66,19.05 53.02,18.41 53.02,17.14 52.39,16.51 R52.2
  Bottom 0.254: DA1.12 45.72,17.78 52.7,17.78 v53.98,19.05
CV1  (via drill 0.33, 0.35)
  Top 0.254: R11.1 13.97,13.34 v12.7,12.06 | v13.65,6.67 14.29,6.03 16.19,6.03 SV33.8
  Bottom 0.254: v12.7,12.06 12.7,7.62 v13.65,6.67
CV2
  Top 0.254: R2.1 13.97,7.62 14.76,6.83 20.48,6.83 21.59,5.71 SV1.1
CV2_IN
  Top 0.254: R2.2 13.97,10.16 | 13.97,10.16 DA2.3 | R3.2 12.7,10.16 13.97,10.16
CV3
  Top 0.254: R8.1 21.59,13.49 20.32,12.22 20.32,8.26 23.02,5.56 24.13,5.56 SV1.2
CV4
  Top 0.254: R5.1 21.59,7.94 23.18,6.35 25.56,6.35 26.67,5.24 SV1.3
CV5  (via drill 0.33)
  Top 0.254: R23.1 64.77,13.34 v63.5,12.06 | SV3.3 66.99,6.03 64.61,6.03 v63.5,7.14
  Bottom 0.254: v63.5,7.14 v63.5,12.06
CV6
  Top 0.254: R14.1 64.77,7.75 65.56,6.96 68.6,6.96 SV3.4
CV6_IN
  Top 0.254: R14.2 64.77,10.16 | 64.77,10.16 DA3.3 | R15.2 63.5,10.16 64.77,10.16
CV7
  Top 0.254: SV3.5 71.12,6.99 71.12,13.47 R20.1
CV8
  Top 0.254: R17.1 72.39,7.62 75.41,4.6 76.04,4.6 SV3.6
CV_A_DRY
  Top 0.254: R35.1 39.37,13.34 38.1,12.06 38.1,7.94 39.21,6.83 39.21,3.33 SV1.8
CV_A_WET
  Top 0.254: SV4.4 50.01,5.24 48.26,5.24 45.72,7.78 45.72,14.42 R32.1
CV_B_DRY
  Top 0.254: R26.1 40.64,6.99 SV4.1
CV_B_WET
  Top 0.254: R29.1 46.51,7.78 48.26,6.03 51.12,6.03 53.98,3.17 SV4.5
CV_O2
  Top 0.254: R27.2 39.37,10.18 | 39.37,10.18 DA1.3 | R26.2 40.64,10.18 39.37,10.18
DGND  (via drill 0.33)
  Top 0.254: IC1.21 34.92,26.38 v34.92,25.42 34.21,24.7 31.53,24.7 30.48,23.65 26.35,23.65 26.04,23.97 25.4,23.97 | v40.16,21.75 40.09,21.67 IC1.12 | v32.23,26.67 27.46,26.67 27.46,25.88 | C23.1 27.46,25.88 | 2.22,24.13 3.97,25.88 8.89,25.88 | 2.22,24.13 0.64,22.55 v0.64,6.2 v0.64,6.19 | 25.4,23.97 18.89,23.97 | 18.89,23.97 14.92,23.97 | 14.92,23.97 7.94,23.97 | 7.94,23.97 4.6,23.97 3.49,22.86 3.49,6.35 4.76,5.08 8.57,5.08 8.89,4.76 SV33.4 | 8.89,25.88 13.97,25.88 | 13.97,25.88 18.89,25.88 | 18.89,25.88 25.4,25.88 | 25.4,25.88 27.46,25.88 | IC1.2 33.59,19.93 33.34,19.68 32.54,19.68 32.38,19.84 v32.38,20.32 | v8.89,26.35 8.89,25.88 | v13.97,26.35 13.97,25.88 | v14.92,23.81 14.92,23.97 | v7.94,23.81 7.94,23.97 | v1.91,24.61 2.22,24.29 2.22,24.13 | v18.89,26.35 18.89,25.88 | v25.4,26.35 25.4,25.88 | v25.4,23.81 25.4,23.97 | v18.89,23.81 18.89,23.97
  Bottom 0.254: v34.92,25.42 34.92,23.65 | 34.92,23.65 34.92,21.43 | v40.16,21.75 39.85,21.43 34.92,21.43 | v32.23,26.67 32.23,24.45 33.02,23.65 34.92,23.65 | v3.68,6.22 0.67,6.22 v0.64,6.19 | 34.92,21.43 33.5,21.43 v32.38,20.32
  pour Bottom: 31.75,26.67 31.91,26.83 40.32,26.83 41.59,25.56 41.59,21.59 40.16,20.16 32.38,20.16 31.75,20.8
  pour Bottom: 9.53,4.29 5.87,7.94 5.4,7.94 3.97,9.37 3.97,20.48 5.4,21.91 5.4,26.35 5.24,26.51 -0.48,26.51 -0.48,-0.48 9.53,-0.48
  pour Bottom: 7.3,26.51 7.14,26.35 7.14,22.07 7.3,21.91 15.56,21.91 15.72,22.07 15.72,26.35 15.56,26.51
  pour Bottom: 17.3,26.35 17.3,22.07 18.41,20.95 25.4,20.95 25.88,21.43 25.88,26.35 25.72,26.51 17.46,26.51
DIG_1_BUS_A  (via drill 0.33)
  Top 0.254: IC1.4 34.92,20.61 34.92,21.59 34.61,21.91 32.54,21.91 31.43,20.8 20.64,20.8 18.89,22.54 4.45,22.54 v4.29,22.7 | IC8.1 v2.54,26.35
  Bottom 0.254: v2.54,26.35 2.54,24.45 v4.29,22.7
DIG_1_BUS_B  (via drill 0.33)
  Top 0.254: IC1.5 35.54,21.77 34.92,22.38 32.38,22.38 31.27,21.27 21.27,21.27 19.37,23.18 v4.76,23.18 | IC8.16 2.54,29.69 3.81,28.42 v3.81,26.35
  Bottom 0.254: v4.76,23.18 3.81,24.13 v3.81,26.35
DIG_2_BUS_A  (via drill 0.33)
  Top 0.254: IC1.6 36.19,22.39 35.72,22.86 32.23,22.86 31.11,21.75 21.91,21.75 v20.32,23.34 | v20.32,26.51 IC8.8
  Bottom 0.254: v20.32,23.34 v20.32,26.51
DIG_2_BUS_B  (via drill 0.33)
  Top 0.254: IC1.7 36.84,22.54 36.04,23.34 32.07,23.34 30.96,22.23 22.7,22.23 v21.59,23.34 | v21.59,26.51 21.59,34.29 IC8.9
  Bottom 0.254: v21.59,23.34 v21.59,26.51
DIG_3_BUS_A  (via drill 0.33)
  Top 0.254: IC1.17 37.49,24.95 36.35,23.81 31.91,23.81 30.8,22.7 23.5,22.7 v22.86,23.34 | v22.86,26.51 IC9.1
  Bottom 0.254: v22.86,23.34 v22.86,26.51
DIG_3_BUS_B  (via drill 0.33)
  Top 0.254: IC1.18 36.84,24.93 36.2,24.29 31.75,24.29 30.64,23.18 24.29,23.18 v24.13,23.34 | IC9.16 22.86,29.53 24.13,28.26 v24.13,26.51
  Bottom 0.254: v24.13,23.34 v24.13,26.51
DIG_4_BUS_A  (via drill 0.33)
  Top 0.254: IC1.19 36.2,25.4 v36.17,25.4
  Bottom 0.254: v36.17,25.4 37.29,25.4 39.83,27.94 IC9.8
DIG_4_BUS_B  (via drill 0.33)
  Top 0.254: IC1.20 35.56,26.39 v35.56,25.4 | v41.43,26.99 41.75,27.3 41.75,28.89 40.64,30 IC9.9
  Bottom 0.254: v35.56,25.4 35.56,25.08 35.88,24.77 37.31,24.77 39.37,26.83 41.27,26.83 v41.43,26.99
DIG_5_BUS_A  (via drill 0.33)
  Top 0.254: IC1.15 38.79,24.87 v38.89,24.77
  Bottom 0.254: v38.89,24.77 40.01,25.88 41.91,25.88 43.18,27.15 IC10.1
DIG_5_BUS_B  (via drill 0.33)
  Top 0.254: IC1.16 38.14,24.8 v38.1,24.77 | IC10.16 43.18,29.53 v42.39,28.73
  Bottom 0.254: v42.39,28.73 42.07,28.42 42.07,26.83 41.59,26.35 39.69,26.35 v38.1,24.77
DIG_6_BUS_A  (via drill 0.33)
  Top 0.254: IC1.13 40.09,25.48 v40.32,25.24 | v60.33,25.56 60.96,26.19 IC10.8
  Bottom 0.254: v40.32,25.24 40.48,25.08 55.4,25.08 55.72,25.4 60.17,25.4 v60.33,25.56
DIG_6_BUS_B  (via drill 0.33)
  Top 0.254: IC1.14 39.44,25.17 v39.85,24.77 | v60.8,25.08 62.07,26.35 62.07,34.45 IC10.9
  Bottom 0.254: v39.85,24.77 40.01,24.61 55.56,24.61 55.88,24.92 60.64,24.92 v60.8,25.08
DIG_7_BUS_A  (via drill 0.33)
  Top 0.254: IC1.8 37.47,20.6 37.47,22.86 v38.26,23.65 | v61.28,24.61 63.5,26.83 IC11.1
  Bottom 0.254: v38.26,23.65 38.73,24.13 55.88,24.13 56.2,24.45 61.12,24.45 v61.28,24.61
DIG_7_BUS_B  (via drill 0.33)
  Top 0.254: IC1.9 38.1,20.61 38.1,22.54 v38.73,23.18 | v61.75,24.13 64.77,27.15 64.77,28.26 63.5,29.53 IC11.16
  Bottom 0.254: v61.75,24.13 61.59,23.97 56.36,23.97 56.04,23.65 39.21,23.65 v38.73,23.18
DIG_8_BUS_A  (via drill 0.33)
  Top 0.254: IC1.10 38.79,22.28 v39.21,22.7 | v79.06,24.92 81.28,27.15 IC11.8
  Bottom 0.254: v79.06,24.92 77.63,23.5 56.52,23.5 56.2,23.18 39.69,23.18 v39.21,22.7
DIG_8_BUS_B  (via drill 0.33)
  Top 0.254: IC1.11 39.44,21.98 v39.69,22.23 | v79.12,23.97 78.48,24.61 78.48,25.4 80.07,26.99 80.07,28.42 81.28,29.62 IC11.9
  Bottom 0.254: v79.12,23.97 78.17,23.02 56.58,23.02 56.26,22.7 40.16,22.7 v39.69,22.23
GND  (via drill 0.33)
  Top 0.254: R6.1 v22.86,7.62 | R30.1 v47.62,7.62 | IC4.12 51.42,26.97 v52.07,27.62 52.72,26.97 IC4.10 | IC4.3 51.42,19.99 v50.8,19.37 | IC4.5 52.72,20.15 v53.34,19.53
  Top 0.508: C2.2 26.04,13.65 26.67,13.02 DA2.8 | DA3.8 77.47,13.02 76.82,13.66 76.82,14.58 C4.2 | C6.2 51.12,13.65 52.07,12.7 DA1.8
  Bottom 0.61: 26.04,14.92 7.3,14.92
  other vias: 5.24,29.69 5.08,33.97 13.49,32.7 13.49,31.43 13.49,30.16 20.32,32.7 20.32,31.43 20.32,30.16 23.5,32.7 23.5,31.43 23.5,30.16 27.3,32.7 27.3,31.43 27.3,30.16 30.48,32.7 30.48,31.43 30.48,30.16 35.24,32.7 34.29,28.57 29.21,28.57 13.97,28.57 9.05,29.53 52.55,32.7 52.55,31.43 52.55,30.16 49.53,28.57 60.96,32.7 60.96,31.43 60.96,30.16 67.94,32.7 69.22,30.16 69.37,32.7 73.18,30.16 73.18,31.43 73.18,32.7 80.64,32.86 81.92,32.86 81.92,30.32 80.64,30.32 77.47,22.07 75.41,24.61 69.06,25.08 68.58,20.32 73.5,21.43 64.45,25.08 63.66,20.95 60.8,20.95 5.24,15.72 13.34,7.78 20.32,4.6 16.51,4.6 25.4,4.6 27.94,4.6 33.02,0.64 22.86,4.6 30.96,7.14 44.61,4.76 50.96,5.08 78.74,5.71 81.28,23.97 36.83,30.16 36.83,28.57 78.26,26.35 78.42,29.05 55.88,15.24 59.53,15.24 61.44,5.24 63.66,5.24 66.04,5.24 15.08,14.92 17.78,14.92 20.32,14.92 22.86,12.54 17.78,12.54 35.56,15.88 41.91,13.02 40.8,14.61 49.05,13.02 44.13,13.02 66.04,10.48 68.58,13.02 68.58,15.24 71.75,10.16 74.3,10.16 31.27,15.24 9.37,15.4 7.46,9.84 7.78,17.94 12.06,17.46 12.06,10.32 22.86,19.05 20.32,19.05 25.4,19.05 32.38,10.64 35.56,4.29 55.88,3.97 50.8,0.48 68.74,5.24 14.13,4.6 57.78,21.27
  pour Bottom: -0.48,36.99 84.61,36.99 84.61,-0.48 13.34,-0.48 13.34,3.97 12.22,5.08 10.48,5.08 6.19,9.37 5.56,9.37 4.76,10.16 4.76,20 5.87,21.11 17.3,21.11 18.26,20.16 31.27,20.16 32.54,18.89 40.01,18.89 43.02,21.91 62.23,21.91 62.71,22.38 62.71,24.29 60.64,26.35 59.37,26.35 58.9,25.88 44.77,25.88 44.29,26.35 44.29,28.42 39.21,28.42 38.73,27.94 -0.48,27.94
  pour Top: 0.64,37.31 84.3,37.31 84.3,-0.95 13.34,-0.95 13.34,3.97 12.22,5.08 10.48,5.08 6.19,9.37 5.56,9.37 4.76,10.16 4.76,20 5.87,21.11 17.46,21.11 19.05,19.53 31.91,19.53 32.54,18.89 40.01,18.89 43.02,21.91 43.02,26.83 41.43,28.42 39.21,28.42 38.73,27.94 -0.16,27.94 -0.16,36.67 0.64,37.47
IN1  (via drill 0.33, 0.35)
  Top 0.254: R13.1 11.43,13.34 v10.16,12.06 | v11.11,6.03 11.91,6.03 13.97,3.97 SV33.6
  Bottom 0.254: v10.16,12.06 10.16,6.99 v11.11,6.03
IN2
  Top 0.254: R4.1 11.43,7.62 13.65,5.4 14.29,5.4 SV33.7
IN3  (via drill 0.33)
  Top 0.254: v26.83,8.26 25.4,9.68 25.4,12.38 24.13,13.65 R10.1
  Bottom 0.254: SV1.4 29.21,5.87 v26.83,8.26
IN4
  Top 0.254: R7.1 24.13,7.75 24.74,7.14 27.78,7.14 SV1.5
IN5  (via drill 0.33)
  Top 0.254: R25.1 62.23,13.34 v60.96,12.06 | SV3.1 61.28,6.67 v60.96,6.67
  Bottom 0.254: v60.96,6.67 v60.96,12.06
IN6
  Top 0.254: R16.1 62.23,7.46 65.09,4.6 66.67,4.6 67.31,3.97 SV3.2
IN7  (via drill 0.33)
  Top 0.254: v73.66,12.06 74.93,13.34 R22.1 | SV3.7 77.31,5.87 75.25,5.87 v74.45,6.67
  Bottom 0.254: v73.66,12.06 73.66,7.46 v74.45,6.67
IN8
  Top 0.254: R19.1 74.93,7.78 75.56,7.14 78.58,7.14 SV3.8
IN_O1
  Top 0.254: DA1.15 R37.2
IN_O2
  Top 0.254: R28.2 DA1.2
IN_O3
  Top 0.254: R34.2 48.1,17.62 DA1.10
IN_O4
  Top 0.254: R31.2 DA1.7
N$1
  Top 0.254: R39.2 DA3.1
N$2
  Top 0.254: R38.2 DA2.1
N$3
  Top 0.254: R17.2 72.39,10.16 | 72.39,10.16 DA3.6 | R18.2 73.66,10.16 72.39,10.16
N$4  (via drill 0.33)
  Top 0.254: v80.96,13.34 IC6.3 80.97,11.44 81.3,11.11 81.6,11.11 81.76,10.95 81.76,10.48 81.6,10.32 R46.1
  Bottom 0.254: DA3.5 71.44,13.02 78.11,13.02 78.9,12.22 79.85,12.22 v80.96,13.34
N$5
  Top 0.254: R20.2 72.39,17.78 | 72.39,17.78 DA3.11 | R21.2 73.66,17.78 72.39,17.78
N$6  (via drill 0.33)
  Top 0.254: R50.2 54.58,9.42 v54.58,11.43 IC2.9
  Bottom 0.254: DA1.5 45.72,10.16 53.31,10.16 v54.58,11.43
N$7
  Top 0.254: R23.2 64.77,17.78 | 64.77,17.78 DA3.14 | R24.2 63.5,17.78 64.77,17.78
N$8
  Top 0.254: R39.1 59.69,7.62 60.96,7.62 C14.2
N$9
  Top 0.254: DA1.1 R40.2
N$10
  Top 0.254: R5.2 21.59,10.16 | 21.59,10.16 DA2.6 | R6.2 22.86,10.16 21.59,10.16
N$11
  Top 0.254: R29.2 46.51,10.16 46.99,10.16 | 46.99,10.16 DA1.6 | R30.2 47.62,10.16 46.99,10.16
N$12
  Top 0.254: R8.2 21.59,17.78 | 21.59,17.78 DA2.11 | R9.2 22.86,17.78 21.59,17.78
N$13
  Top 0.254: R32.2 45.4,17.46 45.72,17.78 46.51,17.78 | DA1.11 46.99,18.1 46.67,17.78 46.51,17.78 | 46.51,17.78 R33.2
N$14
  Top 0.254: R38.1 8.89,7.62 10.16,7.62 C13.2
N$15
  Top 0.254: R35.2 39.37,17.78 | 39.37,17.78 DA1.14 | R36.2 38.1,17.78 39.37,17.78
N$16
  Top 0.254: R40.1 34.29,7.62 35.56,7.62 C15.2
N$17  (via drill 0.33)
  Top 0.254: R51.1 DA1.4 | IC2.10 55.24,12.4 v55.24,11.43
  Bottom 0.254: v55.24,11.43 55.24,11.11 53.66,9.53 44.45,9.53 42.55,11.43 DA1.4
N$18  (via drill 0.33)
  Top 0.254: v55.24,17.14 55.23,17.16 IC2.5 | R49.1 DA1.13
  Bottom 0.254: DA1.13 43.81,17.14 v55.24,17.14
N$19  (via drill 0.33)
  Top 0.254: IC6.5 81.6,18.19 81.6,20.32 | 81.6,20.32 R47.1 | DA3.12 71.12,20.32 v76.99,20.32 | v78.42,21.27 81.28,21.27 81.6,20.95 81.6,20.32
  Bottom 0.254: v78.42,21.27 77.47,20.32 v76.99,20.32
N$21
  Top 0.254: R11.2 13.97,17.78 | 13.97,17.78 DA2.14 | R12.2 12.7,17.78 13.97,17.78
OUT1  (via drill 0.33)
  Top 0.254: IC3.7 5.4,18.17 v5.4,19.21 4.6,19.21 4.6,20 R44.1 | R59.1 6.35,30.8 | R60.1 6.35,32.7 6.35,30.8 | 6.35,30.8 v6.35,27.3
  Bottom 0.254: v6.35,27.3 6.35,20.16 v5.4,19.21
OUT2  (via drill 0.33)
  Top 0.254: R54.1 16.51,32.7 16.51,30.8 | 16.51,30.8 R53.1 | v16.51,20.64 v7.46,20.64 | v16.51,27.3 16.51,30.8 | R41.1 4.6,10.48 4.6,11.27 4.74,11.41 IC3.1 4.74,14.11 v6.51,15.88
  Bottom 0.254: v7.46,20.64 7.46,20 6.67,19.21 6.67,16.03 v6.51,15.88 | v16.51,20.64 v16.51,27.3
OUT3  (via drill 0.33)
  Top 0.254: R58.1 26.67,32.7 26.67,30.8 | 26.67,30.8 R57.1 | v26.67,27.3 26.67,30.8 | R43.1 28.26,19.37 v28.26,18.57 28.57,18.26 28.57,16.19 29.05,15.72 29.53,15.72 30.16,16.35 IC5.7
  Bottom 0.254: v28.26,18.57 28.26,23.02 26.67,24.61 v26.67,27.3
OUT4  (via drill 0.33)
  Top 0.254: R55.1 36.83,30.8 36.83,31.43 | R56.1 36.83,32.7 36.83,31.43 | v31.75,16.51 31.27,16.51 28.53,13.77 28.53,13.34 | v31.75,27.46 31.75,28.26 33.02,29.53 34.92,29.53 35.24,29.84 35.24,31.43 36.83,31.43 | R42.1 28.1,10.64 28.1,11.43 28.53,11.86 28.53,13.34 | IC5.1 29.5,13.04 29.21,13.34 28.53,13.34
  Bottom 0.254: v31.75,27.46 31.11,26.83 31.11,20.64 31.75,20 v31.75,16.51
OUT5  (via drill 0.33)
  Top 0.254: R68.1 44.45,32.7 44.45,30.8 | R67.1 44.45,30.8 | 44.45,30.8 v44.45,21.91 | IC2.1 57.83,19.64 v57.47,20 56.99,19.53 R48.1
  Bottom 0.254: v44.45,21.91 55.56,21.91 v57.47,20
OUT6  (via drill 0.33)
  Top 0.254: R61.1 60.03,30.8 | R62.1 60.01,32.7 60.03,32.68 60.03,30.8 | 60.03,30.8 60.03,29.23 59.69,28.89 59.69,25.24 60.01,24.92 60.01,21.11 58.42,19.53 58.42,15.72 57.83,15.13 IC2.14 57.83,10.52 v57.78,10.48 | v57.15,7.62 R45.1
  Bottom 0.254: v57.78,10.48 57.78,8.26 v57.15,7.62
OUT7
  Top 0.254: R65.1 67.31,30.8 67.31,31.43 | 67.31,31.43 67.31,32.7 R66.1 | 67.31,31.43 68.9,31.43 69.85,30.48 69.85,27.46 76.04,21.27 77.15,21.27 79.22,19.21 80.33,19.21 | 80.33,19.21 80.8,19.21 80.97,19.04 IC6.6 | 80.33,19.21 80.33,18.17 IC6.7
OUT8  (via drill 0.33)
  Top 0.254: R63.1 77.47,30.8 | 77.47,30.8 77.47,32.7 R64.1 | 77.47,30.8 77.47,24.45 79.85,22.07 v81.6,22.07 | IC6.1 79.67,13.31 v79.69,13.34 79.85,13.49 80.17,13.49 80.33,13.34 IC6.2
  Bottom 0.254: v81.6,22.07 81.6,15.88 79.69,13.97 v79.69,13.34
OUT_A  (via drill 0.33)
  Top 0.254: SV4.2 45.24,4.92 v45.24,6.67 | v52.86,6.67 53.34,7.14 53.34,13.97 | IC2.7 53.93,15.51 53.34,14.92 53.34,13.97 | R52.1 52.39,14.29 52.7,13.97 53.34,13.97
  Bottom 0.254: v52.86,6.67 v45.24,6.67
OUT_B  (via drill 0.33)
  Top 0.254: SV4.3 46.99,5.71 v46.35,5.71 | IC2.8 53.93,7.3 | 53.93,7.3 53.93,6.15 v53.5,5.71 | R50.1 54.61,7.62 54.29,7.3 53.93,7.3
  Bottom 0.254: v46.35,5.71 v53.5,5.71
SCL
  Top 0.254: IC1.22 34.24,25.66 33.66,25.08 31.27,25.08 30.32,24.13 26.67,24.13 26.35,24.45 4.45,24.45 3.02,23.02 3.02,6.03 4.6,4.45 5.08,4.45 SV33.3
SDA
  Top 0.254: IC1.23 33.59,25.65 33.5,25.56 31.11,25.56 30.16,24.61 26.99,24.61 26.67,24.92 4.29,24.92 2.54,23.18 2.54,4.45 SV33.2
SUM1
  Top 0.254: R13.2 DA2.15
SUM2
  Top 0.254: R4.2 DA2.2
SUM3
  Top 0.254: R10.2 DA2.10
SUM4
  Top 0.254: R7.2 DA2.7
SUM5
  Top 0.254: R25.2 DA3.15
SUM6
  Top 0.254: R16.2 DA3.2
SUM7
  Top 0.254: R22.2 DA3.10
SUM8
  Top 0.254: R19.2 DA3.7
SUM_A  (via drill 0.33)
  Top 0.254: 49.53,20.64 50.09,20.64 IC4.1 | 49.53,20.64 v49.53,20.8 49.53,21.75 C24.2 | 49.53,20.64 R79.2 | v35.56,15.24 35.56,13.97 | 35.56,13.97 36.83,13.97 R37.1 | v43.34,20.8 41.91,20.8 40.64,19.53 v40.64,15.24 | v35.56,5.08 34.29,3.81 SV1.6 | v35.56,12.06 35.56,13.97
  Bottom 0.254: v43.34,20.8 v49.53,20.8 | v40.64,15.24 v35.56,15.24 | v35.56,5.08 v35.56,12.06
SUM_B  (via drill 0.33)
  Top 0.254: 49.53,26.35 R80.2 | 49.53,26.35 50.09,26.35 IC4.14 | 49.53,26.35 v49.53,26.99 | R28.1 v36.83,7.62 SV1.7 | v45.09,26.04 45.09,21.59 43.18,19.68 v43.18,9.68 | C25.2 49.53,25.24 49.53,26.35
  Bottom 0.254: v49.53,26.99 48.9,26.35 45.4,26.35 v45.09,26.04 | v43.18,9.68 42.39,8.89 38.1,8.89 v36.83,7.62
SUM_FX_A  (via drill 0.33)
  Top 0.254: IC4.7 54.05,20.64 v54.61,20.64 | v54.61,20.64 R81.2 | v48.26,19.68 48.26,18.53 47.31,17.57 47.31,14.29 47.62,13.97 47.94,13.97 48.1,14.13 R34.1 | v54.61,20.64 54.61,21.75 C26.2
  Bottom 0.254: v48.26,19.68 48.74,20.16 54.13,20.16 v54.61,20.64
SUM_FX_B  (via drill 0.33)
  Top 0.254: IC4.8 54.05,26.35 v54.61,26.35 | v54.61,26.35 R82.2 | v45.09,12.86 44.45,13.49 44.45,17.3 45.72,18.57 v45.72,25.72 | R31.1 49.53,7.46 48.42,7.46 48.42,10.64 48.26,10.79 v48.26,12.7 | v54.61,26.35 54.61,25.24 C27.2
  Bottom 0.254: v54.61,26.35 50.01,26.35 49.37,25.72 v45.72,25.72 | v48.26,12.7 45.24,12.7 v45.09,12.86
SW1A
  Top 0.254: R59.2 3.65,30.8 3.65,30 5.08,28.57 IC8.2
SW1B
  Top 0.254: IC8.15 3.65,34.13 3.65,32.7 R60.2
SW2A
  Top 0.254: R53.2 19.05,30.8 19.05,29.21 IC8.7
SW2B
  Top 0.254: R54.2 19.05,32.7 19.05,34.29 IC8.10
SW3A
  Top 0.254: R57.2 24.13,30.8 24.13,29.21 IC9.2
SW3B
  Top 0.254: R58.2 24.13,32.7 24.13,34.29 IC9.15
SW4A
  Top 0.254: R55.2 39.37,30.8 39.37,29.21 IC9.7
SW4B
  Top 0.254: R56.2 39.37,32.7 39.37,34.29 IC9.10
SW5A
  Top 0.254: IC10.2 46.99,29.21 46.99,30.8 R67.2
SW5B
  Top 0.254: R68.2 46.99,32.7 46.99,34.29 IC10.15
SW6A
  Top 0.254: IC10.7 58.42,28.89 57.47,29.84 57.47,30.8 R61.2
SW6B
  Top 0.254: R62.2 57.47,32.7 57.47,34.61 IC10.10
SW7A
  Top 0.254: R65.2 64.77,30.8 64.77,29.21 IC11.2
SW7B
  Top 0.254: R66.2 64.77,32.7 64.77,34.29 IC11.15
SW8A
  Top 0.254: R63.2 80.01,30.8 80.01,29.21 IC11.7
SW8B
  Top 0.254: R64.2 80.01,32.7 80.01,34.29 IC11.10
VL
  Top 0.254: IC9.12 33.02,33.02 | 33.02,33.02 R78.1 | 33.02,33.02 33.66,33.02 33.66,30.48 34.29,30.48 R77.2
  Bottom 0.254: IC8.12 12.7,34.29 33.02,34.29 | IC11.12 73.66,34.29 53.34,34.29 | 33.02,34.29 53.34,34.29 | IC10.12 53.34,34.29 | IC9.12 33.02,34.29

### Text on the board
tNames: Pre-filter bus mixer / DG412 version v1.2 | 4VOB
bNames: +3V3 | SDA | SCL | DGND | RST | In 1 | In 2 | CV 1 | CV 2 | CV 3 | CV 4 | In 3 | In 4 | SUM A | SUM B | CV A | CV B | OUT A | OUT B | CV FX A | CV FX B | +12V | AGND | -12V | In 5 | In 6 | CV 5 | CV 6 | CV 7 | CV 8 | In 7 | In 8